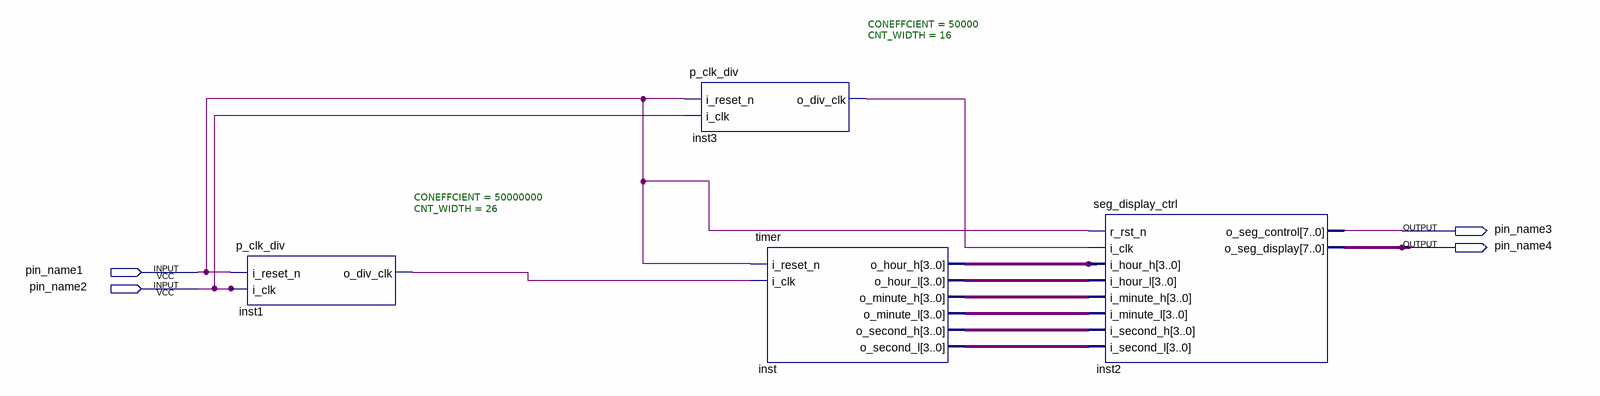
[diagram p0: schematic sheet]
// Quartus schematic ClockDemo.bdf as structural Verilog: 4 symbols, 4 pins
module ClockDemo (
  input  pin_name1,
  input  pin_name2,
  output pin_name3,
  output pin_name4
);

  wire inst1_o_div_clk, inst3_o_div_clk;
  wire [3:0] inst_o_hour_h, inst_o_hour_l, inst_o_minute_h, inst_o_minute_l, inst_o_second_h, inst_o_second_l;
  wire [7:0] inst2_o_seg_display;

  p_clk_div #(.CONEFFCIENT(50000000), .CNT_WIDTH(26)) inst1 (
    .i_reset_n(pin_name1), .i_clk(pin_name2), .o_div_clk(inst1_o_div_clk));
  p_clk_div #(.CONEFFCIENT(50000), .CNT_WIDTH(16)) inst3 (
    .i_reset_n(pin_name1), .i_clk(pin_name2), .o_div_clk(inst3_o_div_clk));
  timer inst (
    .i_reset_n(pin_name1), .i_clk(inst1_o_div_clk), .o_hour_h(inst_o_hour_h), .o_hour_l(inst_o_hour_l),
    .o_minute_h(inst_o_minute_h), .o_minute_l(inst_o_minute_l), .o_second_h(inst_o_second_h),
    .o_second_l(inst_o_second_l));
  seg_display_ctrl inst2 (
    .r_rst_n(pin_name1), .i_clk(inst3_o_div_clk), .i_hour_h(inst_o_hour_h), .i_hour_l(inst_o_hour_l),
    .i_minute_h(inst_o_minute_h), .i_minute_l(inst_o_minute_l), .i_second_h(inst_o_second_h),
    .i_second_l(inst_o_second_l), .o_seg_control(pin_name3), .o_seg_display(inst2_o_seg_display));
endmodule
